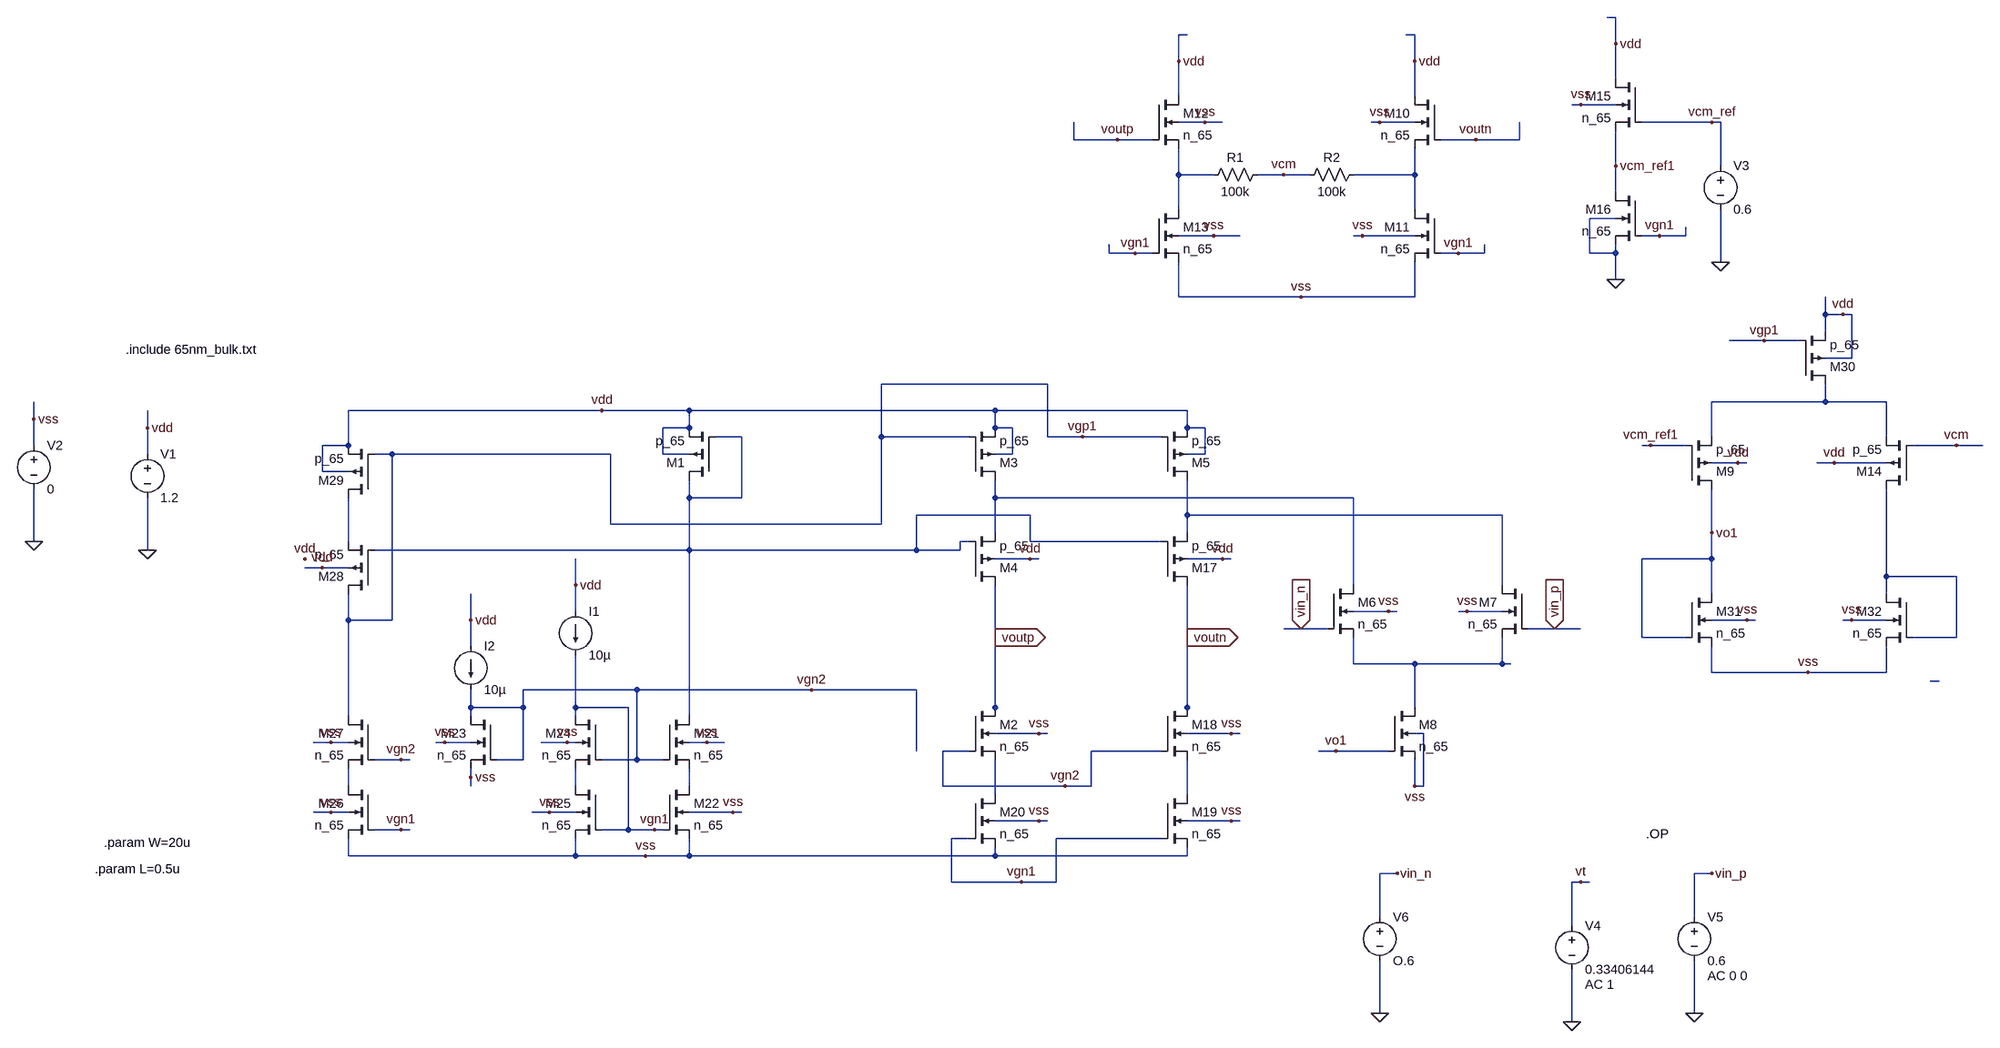
[diagram p0: schematic Draft1.asc]
Draft1.asc, the LTspice schematic file:
Version 4
SHEET 1 1876 1648
WIRE 1200 -208 1184 -208
WIRE 416 -176 400 -176
WIRE 832 -176 816 -176
WIRE 1200 -160 1200 -208
WIRE 400 -128 400 -176
WIRE 832 -128 832 -176
WIRE 1200 -96 1200 -160
WIRE 400 -64 400 -128
WIRE 832 -64 832 -128
WIRE 1136 -48 1120 -48
WIRE 1200 -48 1136 -48
WIRE 448 -16 400 -16
WIRE 480 -16 448 -16
WIRE 768 -16 752 -16
WIRE 832 -16 768 -16
WIRE 1376 -16 1248 -16
WIRE 1392 -16 1376 -16
WIRE 208 16 208 -16
WIRE 288 16 208 16
WIRE 352 16 288 16
WIRE 944 16 880 16
WIRE 1024 16 1024 -16
WIRE 1024 16 944 16
WIRE 1200 64 1200 0
WIRE 1392 64 1392 -16
WIRE 400 80 400 32
WIRE 464 80 400 80
WIRE 592 80 544 80
WIRE 640 80 592 80
WIRE 832 80 832 32
WIRE 832 80 720 80
WIRE 1200 112 1200 64
WIRE 400 144 400 80
WIRE 832 144 832 80
WIRE 1200 160 1152 160
WIRE 464 192 400 192
WIRE 512 192 464 192
WIRE 736 192 720 192
WIRE 832 192 736 192
WIRE 1280 192 1248 192
WIRE 1328 192 1328 176
WIRE 1328 192 1280 192
WIRE 272 224 272 208
WIRE 320 224 272 224
WIRE 352 224 320 224
WIRE 912 224 880 224
WIRE 960 224 960 208
WIRE 960 224 912 224
WIRE 1152 224 1152 160
WIRE 1200 224 1200 208
WIRE 1200 224 1152 224
WIRE 1392 240 1392 144
WIRE 1200 272 1200 224
WIRE 400 304 400 240
WIRE 624 304 400 304
WIRE 832 304 832 240
WIRE 832 304 624 304
WIRE 1584 336 1584 304
WIRE 1616 336 1584 336
WIRE 1632 336 1616 336
WIRE 1584 368 1584 336
WIRE 1472 384 1408 384
WIRE 1536 384 1472 384
WIRE 1632 416 1632 336
WIRE 1632 416 1584 416
WIRE 160 464 -144 464
WIRE 1584 496 1584 464
WIRE 1584 496 1376 496
WIRE 1696 496 1584 496
WIRE -656 512 -1120 512
WIRE -496 512 -656 512
WIRE 64 512 -496 512
WIRE 416 512 64 512
WIRE -1696 528 -1696 496
WIRE -1488 544 -1488 512
WIRE -496 544 -496 512
WIRE -496 544 -544 544
WIRE 64 544 64 512
WIRE 96 544 64 544
WIRE 416 544 416 512
WIRE 448 544 416 544
WIRE -400 560 -448 560
WIRE -144 560 -144 464
WIRE 16 560 -144 560
WIRE 160 560 160 464
WIRE 224 560 160 560
WIRE 368 560 224 560
WIRE 1376 560 1376 496
WIRE 1696 560 1696 496
WIRE -1696 576 -1696 528
WIRE -1120 576 -1120 512
WIRE -1120 576 -1168 576
WIRE 1264 576 1248 576
WIRE 1328 576 1264 576
WIRE 1824 576 1744 576
WIRE 1872 576 1824 576
WIRE -1488 592 -1488 544
WIRE -1120 592 -1120 576
WIRE -1040 592 -1072 592
WIRE -640 592 -1040 592
WIRE -544 592 -544 544
WIRE -496 592 -544 592
WIRE 96 592 96 544
WIRE 96 592 64 592
WIRE 448 592 448 544
WIRE 448 592 416 592
WIRE 1424 608 1376 608
WIRE 1440 608 1424 608
WIRE 1600 608 1568 608
WIRE 1696 608 1600 608
WIRE -1168 624 -1168 576
WIRE -1120 624 -1168 624
WIRE -496 672 -496 640
WIRE -400 672 -400 560
WIRE -400 672 -496 672
WIRE 64 672 64 640
WIRE 720 672 64 672
WIRE 128 704 -80 704
WIRE 416 704 416 640
WIRE 992 704 416 704
WIRE -640 720 -640 592
WIRE -144 720 -144 560
WIRE -144 720 -640 720
WIRE 64 736 64 672
WIRE 416 736 416 704
WIRE 1376 736 1376 656
WIRE -1696 752 -1696 656
WIRE -1120 752 -1120 672
WIRE 16 752 0 752
WIRE 128 752 128 704
WIRE 368 752 128 752
WIRE -1488 768 -1488 672
WIRE -496 768 -496 672
WIRE -496 768 -1072 768
WIRE -80 768 -80 704
WIRE -80 768 -496 768
WIRE 0 768 0 752
WIRE 0 768 -80 768
WIRE 128 784 64 784
WIRE 144 784 128 784
WIRE 480 784 416 784
WIRE 496 784 480 784
WIRE 1376 784 1376 736
WIRE 1376 784 1248 784
WIRE -1168 800 -1200 800
WIRE -1120 800 -1168 800
WIRE 1696 816 1696 656
WIRE 1824 816 1696 816
WIRE -704 832 -704 784
WIRE 720 832 720 672
WIRE 992 832 992 704
WIRE 1376 848 1376 784
WIRE 1696 848 1696 816
WIRE -704 880 -704 832
WIRE 784 880 720 880
WIRE 800 880 784 880
WIRE 928 880 912 880
WIRE 992 880 928 880
WIRE -1120 896 -1120 848
WIRE -1040 896 -1040 592
WIRE -1040 896 -1120 896
WIRE -896 896 -896 848
WIRE 1440 896 1376 896
WIRE 1456 896 1440 896
WIRE 1632 896 1616 896
WIRE 1696 896 1632 896
WIRE 624 912 592 912
WIRE 672 912 624 912
WIRE 1088 912 1040 912
WIRE 1136 912 1088 912
WIRE 64 928 64 832
WIRE 416 928 416 832
WIRE 1248 928 1248 784
WIRE 1328 928 1248 928
WIRE 1824 928 1824 816
WIRE 1824 928 1744 928
WIRE -896 944 -896 896
WIRE 720 976 720 928
WIRE 832 976 720 976
WIRE 992 976 992 928
WIRE 992 976 832 976
WIRE 1008 976 992 976
WIRE 1376 992 1376 944
WIRE 1552 992 1376 992
WIRE 1696 992 1696 944
WIRE 1696 992 1552 992
WIRE 1792 1008 1776 1008
WIRE -592 1024 -800 1024
WIRE -272 1024 -592 1024
WIRE -80 1024 -272 1024
WIRE -896 1056 -896 1024
WIRE -800 1056 -800 1024
WIRE -800 1056 -896 1056
WIRE -704 1056 -704 960
WIRE -608 1056 -704 1056
WIRE 64 1056 64 928
WIRE 416 1056 416 928
WIRE 832 1056 832 976
WIRE -1120 1072 -1120 896
WIRE -896 1072 -896 1056
WIRE -704 1072 -704 1056
WIRE -496 1072 -496 768
WIRE 64 1072 64 1056
WIRE 416 1072 416 1056
WIRE 144 1104 64 1104
WIRE 160 1104 144 1104
WIRE 496 1104 416 1104
WIRE 512 1104 496 1104
WIRE 848 1104 832 1104
WIRE -1152 1120 -1184 1120
WIRE -1120 1120 -1152 1120
WIRE -944 1120 -960 1120
WIRE -896 1120 -944 1120
WIRE -720 1120 -768 1120
WIRE -704 1120 -720 1120
WIRE -464 1120 -496 1120
WIRE -432 1120 -464 1120
WIRE -80 1136 -80 1024
WIRE 16 1136 -32 1136
WIRE 368 1136 240 1136
WIRE 688 1136 656 1136
WIRE 784 1136 688 1136
WIRE -1024 1152 -1072 1152
WIRE -1008 1152 -1024 1152
WIRE -800 1152 -800 1056
WIRE -800 1152 -848 1152
WIRE -592 1152 -592 1024
WIRE -592 1152 -656 1152
WIRE -544 1152 -592 1152
WIRE -896 1184 -896 1168
WIRE -1120 1200 -1120 1168
WIRE -896 1200 -896 1184
WIRE -704 1200 -704 1168
WIRE -496 1200 -496 1168
WIRE -32 1200 -32 1136
WIRE 192 1200 -32 1200
WIRE 240 1200 240 1136
WIRE 240 1200 192 1200
WIRE 832 1200 832 1152
WIRE 848 1200 848 1104
WIRE 848 1200 832 1200
WIRE 64 1216 64 1152
WIRE 416 1216 416 1152
WIRE -1152 1248 -1184 1248
WIRE -1120 1248 -1152 1248
WIRE -752 1248 -784 1248
WIRE -704 1248 -752 1248
WIRE -416 1248 -496 1248
WIRE -400 1248 -416 1248
WIRE 144 1264 64 1264
WIRE 160 1264 144 1264
WIRE 496 1264 416 1264
WIRE 512 1264 496 1264
WIRE -1024 1280 -1072 1280
WIRE -1008 1280 -1024 1280
WIRE -608 1280 -608 1056
WIRE -608 1280 -656 1280
WIRE -560 1280 -608 1280
WIRE -544 1280 -560 1280
WIRE 16 1296 -16 1296
WIRE 368 1296 176 1296
WIRE -1120 1328 -1120 1296
WIRE -704 1328 -704 1296
WIRE -704 1328 -1120 1328
WIRE -576 1328 -704 1328
WIRE -496 1328 -496 1296
WIRE -496 1328 -576 1328
WIRE 64 1328 64 1312
WIRE 64 1328 -496 1328
WIRE 416 1328 416 1312
WIRE 416 1328 64 1328
WIRE 800 1360 768 1360
WIRE 1376 1360 1344 1360
WIRE -16 1376 -16 1296
WIRE 112 1376 -16 1376
WIRE 176 1376 176 1296
WIRE 176 1376 112 1376
WIRE 1136 1376 1120 1376
WIRE 1152 1376 1136 1376
WIRE 768 1440 768 1360
WIRE 1344 1440 1344 1360
WIRE 1120 1456 1120 1376
WIRE 768 1616 768 1520
WIRE 1344 1616 1344 1520
WIRE 1120 1632 1120 1536
FLAG -704 832 vdd
FLAG 144 1104 vss
FLAG 144 1264 vss
FLAG -464 1120 vss
FLAG -576 1328 vss
FLAG -896 896 vdd
FLAG -896 1184 vss
FLAG -720 1120 vss
FLAG 128 784 vdd
FLAG -1152 1120 vss
FLAG -1024 1280 vgn1
FLAG -1024 1152 vgn2
FLAG -656 512 vdd
FLAG -1488 768 0
FLAG -1488 544 vdd
FLAG -1696 752 0
FLAG -1696 528 vss
FLAG 64 928 voutp
IOPIN 64 928 Out
FLAG 496 1104 vss
FLAG 496 1264 vss
FLAG 480 784 vdd
FLAG 416 928 voutn
IOPIN 416 928 Out
FLAG 784 880 vss
FLAG 928 880 vss
FLAG 832 1200 vss
FLAG 1552 992 vss
FLAG 1440 896 vss
FLAG 1632 896 vss
FLAG 1616 336 vdd
FLAG 1424 608 vdd
FLAG 1088 912 vin_p
IOPIN 1088 912 In
FLAG 624 912 vin_n
IOPIN 624 912 In
FLAG 224 560 vgp1
FLAG -272 1024 vgn2
FLAG 112 1376 vgn1
FLAG 192 1200 vgn2
FLAG 832 -128 vdd
FLAG 912 224 vgn1
FLAG 944 16 voutn
FLAG 400 -128 vdd
FLAG 320 224 vgn1
FLAG 288 16 voutp
FLAG 624 304 vss
FLAG 592 80 vcm
FLAG 1600 608 vdd
FLAG 1824 576 vcm
FLAG 1472 384 vgp1
FLAG -560 1280 vgn1
FLAG 1200 -160 vdd
FLAG 1280 192 vgn1
FLAG 1392 240 0
FLAG 1376 -16 vcm_ref
FLAG 1200 64 vcm_ref1
FLAG 1264 576 vcm_ref1
FLAG 1200 272 0
FLAG 1376 736 vo1
FLAG 688 1136 vo1
FLAG -1200 784 vdd
FLAG -1168 800 vdd
FLAG -416 1248 vss
FLAG -752 1248 vss
FLAG -944 1120 vss
FLAG -1152 1248 vss
FLAG 464 192 vss
FLAG 736 192 vss
FLAG 448 -16 vss
FLAG 768 -16 vss
FLAG 1136 -48 vss
FLAG 768 1616 0
FLAG 800 1360 vin_n
FLAG 1120 1632 0
FLAG 1344 1616 0
FLAG 1376 1360 vin_p
FLAG 1136 1376 vt
DATAFLAG -160 1024 ""
DATAFLAG -80 784 ""
DATAFLAG 176 544 ""
DATAFLAG 416 528 ""
DATAFLAG 1424 496 ""
DATAFLAG 1376 704 ""
DATAFLAG 1696 768 ""
DATAFLAG 64 880 ""
DATAFLAG 416 880 ""
DATAFLAG 1568 928 ""
DATAFLAG 832 704 ""
DATAFLAG 144 672 ""
DATAFLAG 416 1200 ""
DATAFLAG 64 1200 ""
DATAFLAG 832 1184 ""
DATAFLAG 32 1296 ""
DATAFLAG 272 752 ""
DATAFLAG 256 1280 ""
DATAFLAG 400 48 ""
DATAFLAG 832 64 ""
DATAFLAG 224 16 ""
DATAFLAG 1024 0 ""
DATAFLAG -1056 1152 ""
DATAFLAG -1056 1280 ""
DATAFLAG -640 1152 ""
DATAFLAG -640 1280 ""
DATAFLAG -752 592 ""
DATAFLAG -800 768 ""
DATAFLAG -1120 688 ""
DATAFLAG 1312 -32 ""
DATAFLAG 1360 816 ""
DATAFLAG 720 720 ""
DATAFLAG 832 1024 ""
DATAFLAG 704 1120 ""
DATAFLAG 416 880 ""
DATAFLAG 1200 80 "$"
SYMBOL pmos4 -448 640 R180
SYMATTR InstName M1
SYMATTR Value p_65
SYMATTR Value2 l={L} w=0.25*{W}
SYMBOL nmos4 16 1056 R0
SYMATTR InstName M2
SYMATTR Value n_65
SYMATTR Value2 l={L} w={W}
SYMBOL current -704 880 R0
WINDOW 123 0 0 Left 0
WINDOW 39 0 0 Left 0
SYMATTR InstName I1
SYMATTR Value 10µ
SYMBOL current -896 944 R0
WINDOW 123 0 0 Left 0
WINDOW 39 0 0 Left 0
SYMATTR InstName I2
SYMATTR Value 10µ
SYMBOL pmos4 16 640 M180
SYMATTR InstName M3
SYMATTR Value p_65
SYMATTR Value2 l={L} w=2*{W}
SYMBOL pmos4 16 832 M180
SYMATTR InstName M4
SYMATTR Value p_65
SYMATTR Value2 l={L} w={W}
SYMBOL voltage -1488 576 R0
WINDOW 123 0 0 Left 0
WINDOW 39 0 0 Left 0
SYMATTR InstName V1
SYMATTR Value 1.2
SYMBOL voltage -1696 560 R0
WINDOW 123 0 0 Left 0
WINDOW 39 0 0 Left 0
SYMATTR InstName V2
SYMATTR Value 0
SYMBOL pmos4 368 640 M180
SYMATTR InstName M5
SYMATTR Value p_65
SYMATTR Value2 l={L} w=2*{W}
SYMBOL nmos4 672 832 R0
SYMATTR InstName M6
SYMATTR Value n_65
SYMATTR Value2 l=0.5u w=80u
SYMBOL nmos4 1040 832 M0
SYMATTR InstName M7
SYMATTR Value n_65
SYMATTR Value2 l=0.5u w=80u
SYMBOL nmos4 784 1056 R0
SYMATTR InstName M8
SYMATTR Value n_65
SYMATTR Value2 l={L} w=2*{W}
SYMBOL pmos4 1328 656 M180
SYMATTR InstName M9
SYMATTR Value p_65
SYMATTR Value2 l=65n w=90u
SYMBOL nmos4 880 -64 M0
SYMATTR InstName M10
SYMATTR Value n_65
SYMATTR Value2 l=65n w=20u
SYMBOL nmos4 880 144 M0
SYMATTR InstName M11
SYMATTR Value n_65
SYMATTR Value2 l=500n w=20u
SYMBOL nmos4 352 -64 R0
SYMATTR InstName M12
SYMATTR Value n_65
SYMATTR Value2 l=65n w=20u
SYMBOL nmos4 352 144 R0
SYMATTR InstName M13
SYMATTR Value n_65
SYMATTR Value2 l=500n w=20u
SYMBOL res 560 64 R90
WINDOW 0 0 56 VBottom 2
WINDOW 3 32 56 VTop 2
SYMATTR InstName R1
SYMATTR Value 100k
SYMATTR SpiceLine tol=1 pwr=0.1
SYMBOL res 736 64 R90
WINDOW 0 0 56 VBottom 2
WINDOW 3 32 56 VTop 2
SYMATTR InstName R2
SYMATTR Value 100k
SYMATTR SpiceLine tol=1 pwr=0.1
SYMBOL pmos4 1744 656 R180
SYMATTR InstName M14
SYMATTR Value p_65
SYMATTR Value2 l=65n w=90u
SYMBOL nmos4 1248 -96 M0
SYMATTR InstName M15
SYMATTR Value n_65
SYMATTR Value2 l=500 w=20u
SYMBOL nmos4 1248 112 M0
SYMATTR InstName M16
SYMATTR Value n_65
SYMATTR Value2 l=500n w=20u
SYMBOL voltage 1392 48 R0
WINDOW 123 0 0 Left 0
WINDOW 39 0 0 Left 0
SYMATTR InstName V3
SYMATTR Value 0.6
SYMBOL pmos4 368 832 M180
SYMATTR InstName M17
SYMATTR Value p_65
SYMATTR Value2 l={L} w={W}
SYMBOL nmos4 368 1056 R0
SYMATTR InstName M18
SYMATTR Value n_65
SYMATTR Value2 l={L} w={W}
SYMBOL nmos4 368 1216 R0
SYMATTR InstName M19
SYMATTR Value n_65
SYMATTR Value2 l={L} w={W}
SYMBOL nmos4 16 1216 R0
SYMATTR InstName M20
SYMATTR Value n_65
SYMATTR Value2 l={L} w={W}
SYMBOL nmos4 -544 1072 R0
SYMATTR InstName M21
SYMATTR Value n_65
SYMATTR Value2 l={L} w={W}
SYMBOL nmos4 -544 1200 R0
SYMATTR InstName M22
SYMATTR Value n_65
SYMATTR Value2 l={L} w={W}
SYMBOL nmos4 -848 1072 M0
SYMATTR InstName M23
SYMATTR Value n_65
SYMATTR Value2 l={L} w=0.25*{W}
SYMBOL nmos4 -656 1072 M0
SYMATTR InstName M24
SYMATTR Value n_65
SYMATTR Value2 l={L} w={W}
SYMBOL nmos4 -656 1200 M0
SYMATTR InstName M25
SYMATTR Value n_65
SYMATTR Value2 l={L} w={W}
SYMBOL nmos4 -1072 1200 M0
SYMATTR InstName M26
SYMATTR Value n_65
SYMATTR Value2 l={L} w={W}
SYMBOL nmos4 -1072 1072 M0
SYMATTR InstName M27
SYMATTR Value n_65
SYMATTR Value2 l={L} w={W}
SYMBOL pmos4 -1072 848 R180
SYMATTR InstName M28
SYMATTR Value p_65
SYMATTR Value2 l={L} w={W}
SYMBOL pmos4 -1072 672 R180
SYMATTR InstName M29
SYMATTR Value p_65
SYMATTR Value2 l={L} w={W}
SYMBOL pmos4 1536 464 M180
SYMATTR InstName M30
SYMATTR Value p_65
SYMATTR Value2 l={L} w=2*{W}
SYMBOL nmos4 1328 848 R0
SYMATTR InstName M31
SYMATTR Value n_65
SYMATTR Value2 l={L} w={W}
SYMBOL nmos4 1744 848 M0
SYMATTR InstName M32
SYMATTR Value n_65
SYMATTR Value2 l={L} w={W}
SYMBOL voltage 1120 1440 R0
WINDOW 123 24 124 Left 2
WINDOW 39 0 0 Left 0
SYMATTR Value2 AC 1
SYMATTR InstName V4
SYMATTR Value 0.33406144
SYMBOL voltage 1344 1424 R0
WINDOW 123 24 124 Left 2
WINDOW 39 0 0 Left 0
SYMATTR Value2 AC 0 0
SYMATTR InstName V5
SYMATTR Value 0.6
SYMBOL Voltage 768 1424 R0
SYMATTR InstName V6
SYMATTR Value O.6
TEXT -1528 400 Left 2 !.include 65nm_bulk.txt
TEXT -1568 1304 Left 2 !.param W=20u
TEXT -1584 1352 Left 2 !.param L=0.5u
TEXT 1256 1288 Left 2 !.OP

The netlist it stands for:
* Draft1.asc
M1 N004 N004 vdd vdd p_65 l={L} w=0.25*{W}
M2 voutp vgn2 N014 vss n_65 l={L} w={W}
I1 vdd vgn1 10µ
I2 vdd vgn2 10µ
M3 N005 vgp1 vdd vdd p_65 l={L} w=2*{W}
M4 voutp N004 N005 vdd p_65 l={L} w={W}
V1 vdd 0 1.2
V2 vss 0 0
M5 N006 vgp1 vdd vdd p_65 l={L} w=2*{W}
M6 N005 vin_n N009 vss n_65 l=0.5u w=80u
M7 N006 vin_p N009 vss n_65 l=0.5u w=80u
M8 N009 vo1 vss vss n_65 l={L} w=2*{W}
M9 vo1 vcm_ref1 N003 vdd p_65 l=65n w=90u
M10 vdd voutn N002 vss n_65 l=65n w=20u
M11 N002 vgn1 vss vss n_65 l=500n w=20u
M12 vdd voutp N001 vss n_65 l=65n w=20u
M13 N001 vgn1 vss vss n_65 l=500n w=20u
R1 vcm N001 100k tol=1 pwr=0.1
R2 N002 vcm 100k tol=1 pwr=0.1
M14 N008 vcm N003 vdd p_65 l=65n w=90u
M15 vdd vcm_ref vcm_ref1 vss n_65 l=500 w=20u
M16 vcm_ref1 vgn1 0 0 n_65 l=500n w=20u
V3 vcm_ref 0 0.6
M17 voutn N004 N006 vdd p_65 l={L} w={W}
M18 voutn vgn2 N015 vss n_65 l={L} w={W}
M19 N015 vgn1 vss vss n_65 l={L} w={W}
M20 N014 vgn1 vss vss n_65 l={L} w={W}
M21 N004 vgn2 N013 vss n_65 l={L} w={W}
M22 N013 vgn1 vss vss n_65 l={L} w={W}
M23 vgn2 vgn2 vss vss n_65 l={L} w=0.25*{W}
M24 vgn1 vgn2 N012 vss n_65 l={L} w={W}
M25 N012 vgn1 vss vss n_65 l={L} w={W}
M26 N011 vgn1 vss vss n_65 l={L} w={W}
M27 vgp1 vgn2 N011 vss n_65 l={L} w={W}
M28 vgp1 N004 N007 vdd p_65 l={L} w={W}
M29 N007 vgp1 vdd vdd p_65 l={L} w={W}
M30 N003 vgp1 vdd vdd p_65 l={L} w=2*{W}
M31 vo1 vo1 vss vss n_65 l={L} w={W}
M32 N008 N008 vss vss n_65 l={L} w={W}
V4 vt 0 0.33406144 AC 1
V5 vin_p 0 0.6 AC 0 0
V6 vin_n 0 O.6
.model NMOS NMOS
.model PMOS PMOS
.lib standard.mos
.include 65nm_bulk.txt
.param W=20u
.param L=0.5u
.OP
.backanno
.end